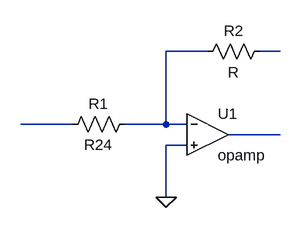
[diagram p0: schematic test1.asc]
test1.asc, the LTspice schematic file:
Version 4
SHEET 1 880 680
WIRE 224 48 160 48
WIRE 336 48 304 48
WIRE 16 160 -64 160
WIRE 160 160 160 48
WIRE 160 160 96 160
WIRE 192 160 160 160
WIRE 336 176 256 176
WIRE 192 192 160 192
WIRE 160 272 160 192
FLAG 160 272 0
SYMBOL res 112 144 R90
WINDOW 0 0 56 VBottom 2
WINDOW 3 32 56 VTop 2
SYMATTR InstName R1
SYMATTR Value R24
SYMBOL res 320 32 R90
WINDOW 0 0 56 VBottom 2
WINDOW 3 32 56 VTop 2
SYMATTR InstName R2
SYMBOL OpAmps\\opamp 224 112 R0
SYMATTR InstName U1

The netlist it stands for:
* test1.asc
R1 N001 N003 R24
R2 N002 N001 R
XU1 N001 0 N004 opamp Aol=100K GBW=10Meg  ; pins invin noninvin out
.backanno
.end